# Altium schematic sheet NGI_Search.SchDoc
size A3; SheetNumber: 1; SheetTotal: 7
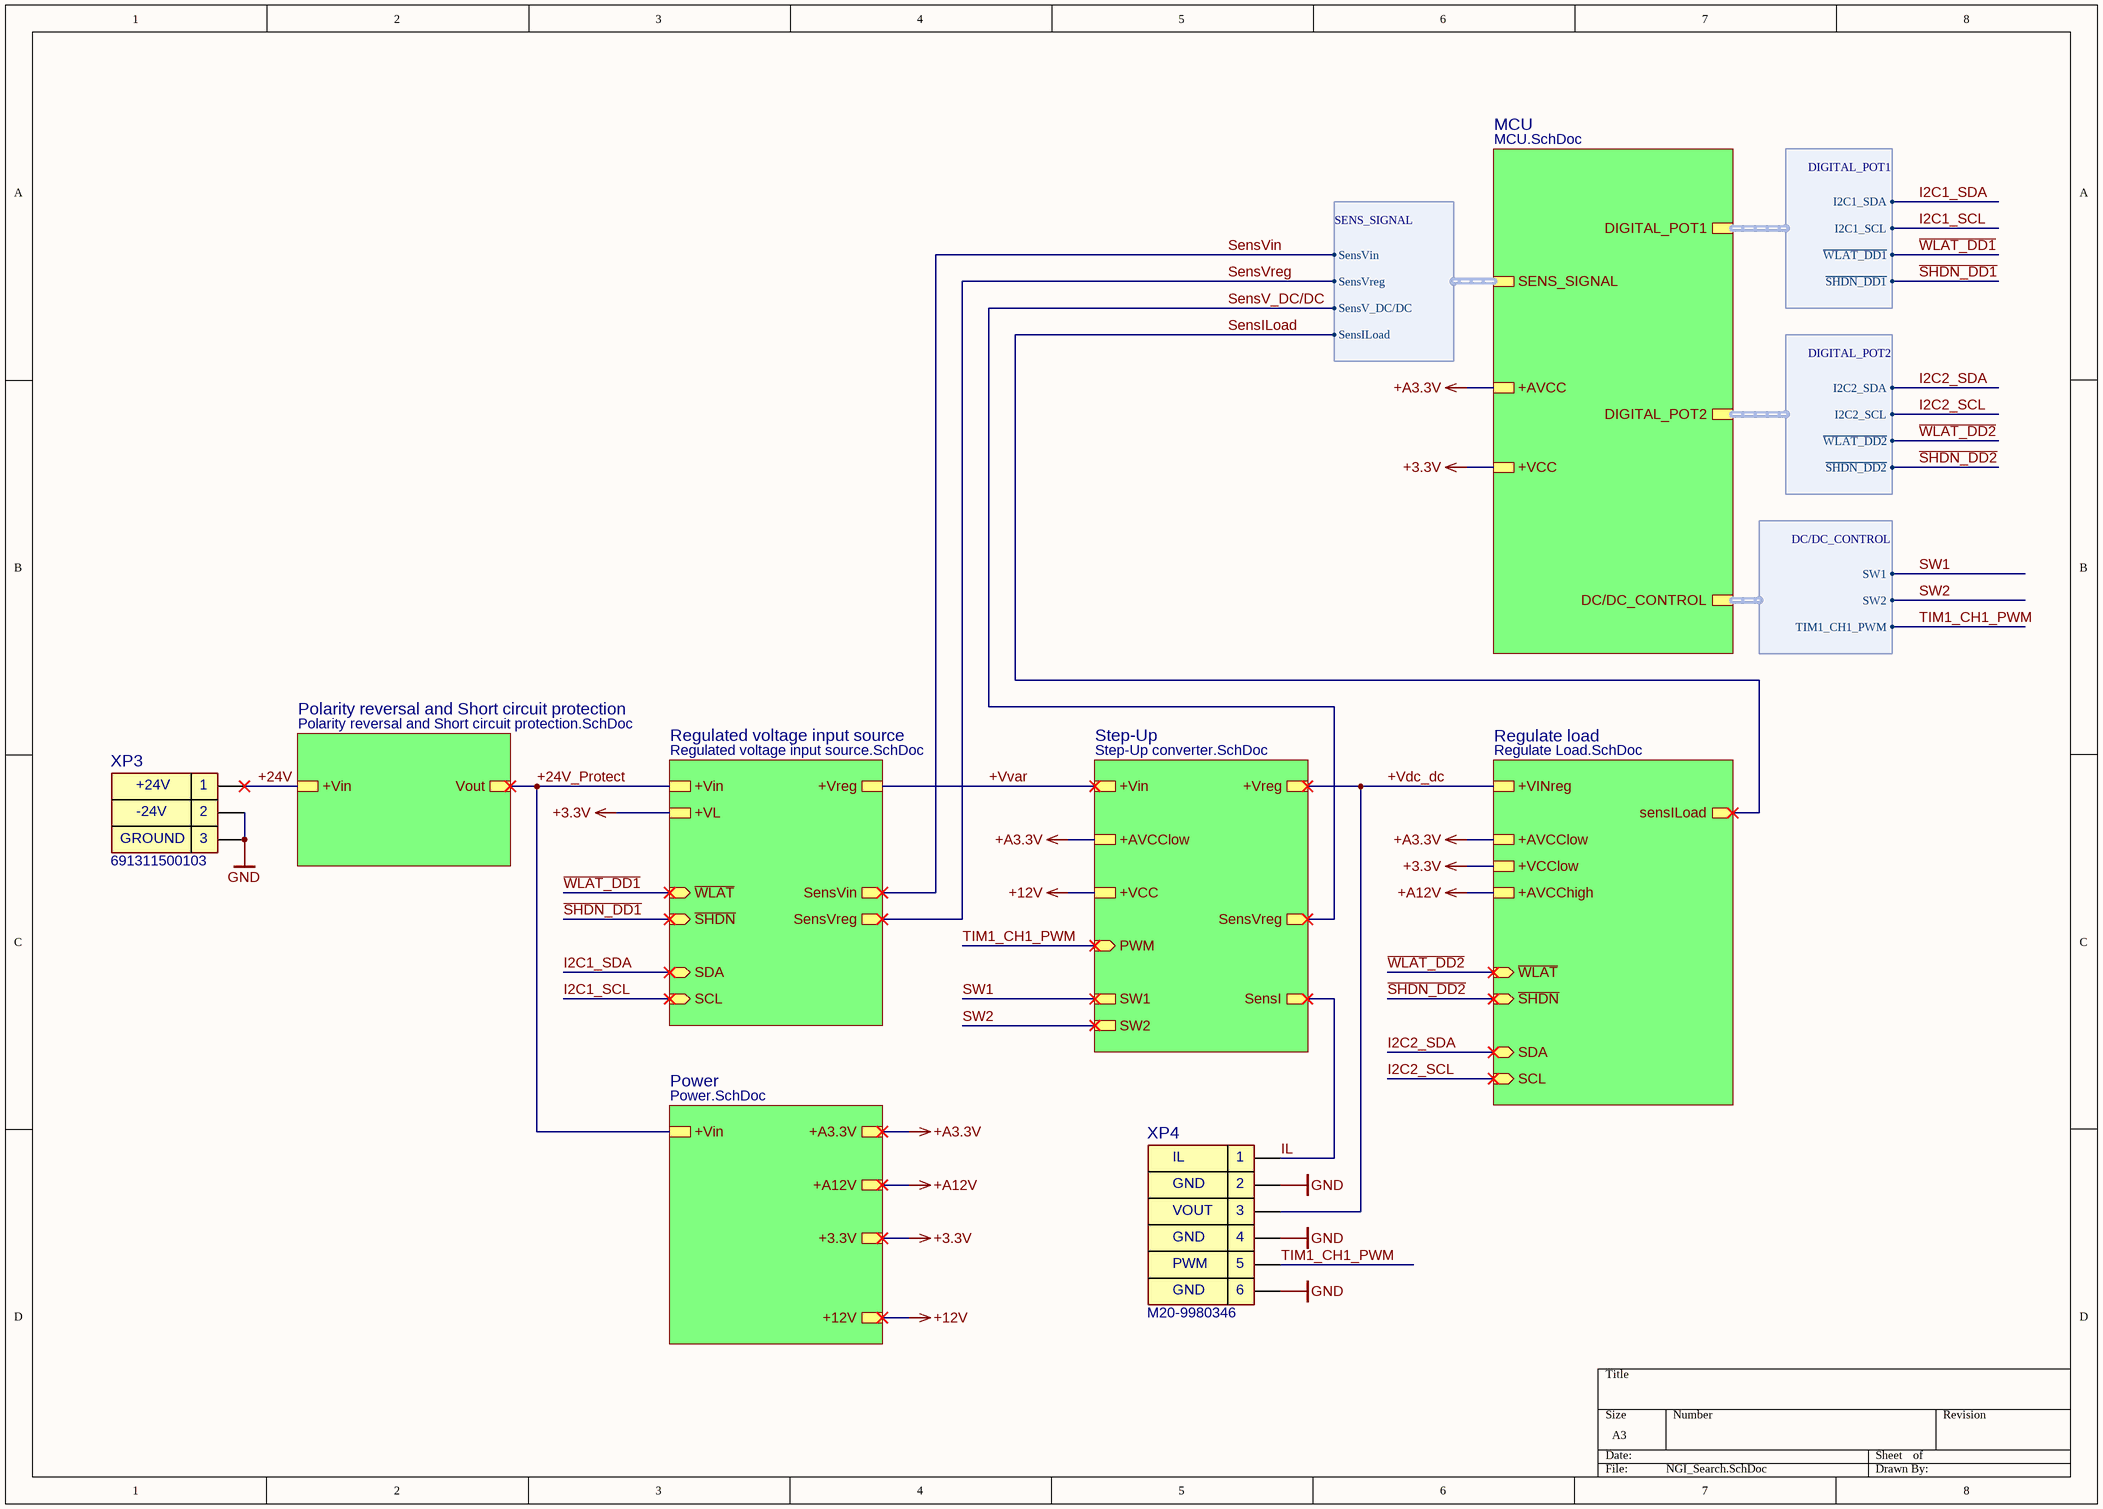
[diagram p0: NGI_Search.SchDoc]

## Parts
XP3  691311500103  [691311500103]
XP4  M20-9980346  [M20-9980346]

## Sub-sheets
MCU = MCU.SchDoc: DIGITAL_POT1 (harness DIGITAL_POT1), DIGITAL_POT2 (harness DIGITAL_POT2), DC/DC_CONTROL (harness DC/DC_CONTROL), SENS_SIGNAL (harness SENS_SIGNAL), +AVCC, +VCC
Polarity reversal and Short circuit protection = Polarity reversal and Short circuit protection.SchDoc: +Vin, Vout
Power = Power.SchDoc: +A12V, +A3.3V, +3.3V, +12V, +Vin
Regulate load = Regulate Load.SchDoc: +AVCClow, +VCClow, SCL (in), SDA (bidir), ~{WLAT} (in), ~{SHDN} (in), +AVCChigh, +VINreg, sensILoad (out)
Regulated voltage input source = Regulated voltage input source.SchDoc: +Vin, +Vreg, SCL (in), SDA (bidir), ~{WLAT} (in), ~{SHDN} (in), SensVin (out), SensVreg (out), +VL
Step-Up = Step-Up converter.SchDoc: +VCC, PWM (in), +AVCClow, +Vreg, SensVreg (out), SensI (out), SW1, SW2, +Vin

## Harnesses
DIGITAL_POT1: I2C1_SDA, I2C1_SCL, ~{WLAT_DD1}, ~{SHDN_DD1}
SENS_SIGNAL: SensVin, SensVreg, SensV_DC/DC, SensILoad
DIGITAL_POT2: I2C2_SDA, I2C2_SCL, ~{WLAT_DD2}, ~{SHDN_DD2}
DC/DC_CONTROL: SW1, SW2, TIM1_CH1_PWM

## Nets
+3.3V: sheet MCU/+VCC, sheet Regulate load/+VCClow, sheet Regulated voltage input source/+VL, sheet Power/+3.3V
+12V: sheet Step-Up/+VCC, sheet Power/+12V
+A3.3V: sheet Step-Up/+AVCClow, sheet MCU/+AVCC, sheet Regulate load/+AVCClow, sheet Power/+A3.3V
+A12V: sheet Regulate load/+AVCChigh, sheet Power/+A12V
GND: XP3.2 XP3.3 XP4.2 XP4.4 XP4.6
+24V: XP3.1 ; sheet Polarity reversal and Short circuit protection/+Vin
+24V_Protect: sheet Polarity reversal and Short circuit protection/Vout, sheet Regulated voltage input source/+Vin, sheet Power/+Vin
+Vdc_dc: XP4.3 ; sheet Step-Up/+Vreg, sheet Regulate load/+VINreg
+Vvar: sheet Step-Up/+Vin, sheet Regulated voltage input source/+Vreg
I2C1_SCL: sheet Regulated voltage input source/SCL, sheet MCU/DIGITAL_POT1.I2C1_SCL
I2C1_SDA: sheet Regulated voltage input source/SDA, sheet MCU/DIGITAL_POT1.I2C1_SDA
I2C2_SCL: sheet Regulate load/SCL, sheet MCU/DIGITAL_POT2.I2C2_SCL
I2C2_SDA: sheet Regulate load/SDA, sheet MCU/DIGITAL_POT2.I2C2_SDA
IL: XP4.1 ; sheet Step-Up/SensI
~{SHDN_DD1}: sheet Regulated voltage input source/~{SHDN}, sheet MCU/DIGITAL_POT1.~{SHDN_DD1}
~{SHDN_DD2}: sheet Regulate load/~{SHDN}, sheet MCU/DIGITAL_POT2.~{SHDN_DD2}
SensILoad: sheet Regulate load/sensILoad, sheet MCU/SENS_SIGNAL.SensILoad
SensV_DC/DC: sheet Step-Up/SensVreg, sheet MCU/SENS_SIGNAL.SensV_DC/DC
SensVin: sheet Regulated voltage input source/SensVin, sheet MCU/SENS_SIGNAL.SensVin
SensVreg: sheet Regulated voltage input source/SensVreg, sheet MCU/SENS_SIGNAL.SensVreg
SW1: sheet Step-Up/SW1, sheet MCU/DC/DC_CONTROL.SW1
SW2: sheet Step-Up/SW2, sheet MCU/DC/DC_CONTROL.SW2
TIM1_CH1_PWM: XP4.5 ; sheet Step-Up/PWM, sheet MCU/DC/DC_CONTROL.TIM1_CH1_PWM
~{WLAT_DD1}: sheet Regulated voltage input source/~{WLAT}, sheet MCU/DIGITAL_POT1.~{WLAT_DD1}
~{WLAT_DD2}: sheet Regulate load/~{WLAT}, sheet MCU/DIGITAL_POT2.~{WLAT_DD2}

## Notes on the sheet
- (near XP3) +24V
- GROUND
- (near XP3) -24V
- IL
- GND
- (near XP4) VOUT
- PWM

## Library data of the parts
XP3 = 691311500103: Pluggable Terminal Blocks WR-TBL 300VAC 20A 3P Vertical; Manufacturer: Wurth Elektronik; Case: 3 VERTICAL PIN Pitch: 5.08 mm; Datasheet Link: https://www.we-online.com/components/products/datasheet/691311500103.pdf; ManufacturerPartNumber: 691311500103; Mouser Part Number: 710-691311500103; Mouser Price/Stock: https://eu.mouser.com/ProductDetail/Wurth-Elektronik/691311500103?qs=2kOmHSv6VfTr95JPv5RlIw%3D%3D
XP4 = M20-9980346: Headers & Wire Housings 03+03 DIL VERTICAL PIN HEADER TIN; Manufacturer: Harwin; Case: 03+03 DIL VERTICAL PIN; Datasheet Link: https://eu.mouser.com/datasheet/2/181/M20-998-1220570.pdf; ManufacturerPartNumber: M20-9980346; Mouser Part Number: 855-M20-9980346; Mouser Price/Stock: https://eu.mouser.com/ProductDetail/Harwin/M20-9980346?qs=%252Bk6%2F5FB6qrmHk2P20oz3FA%3D%3D